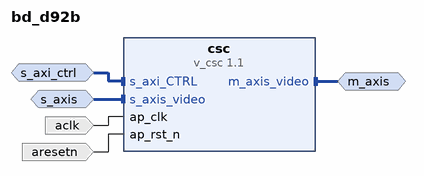
[diagram p0: block diagram of the top level]
# Vivado block design bd_d92b, xczu2cg-sfvc784-1-e, Vivado 2025.2
create_bd_design bd_d92b

create_bd_intf_port -mode Slave -vlnv xilinx.com:interface:aximm_rtl:1.0 s_axi_ctrl
set_property -dict {CONFIG.ADDR_WIDTH 16 CONFIG.PROTOCOL AXI4LITE} [get_bd_intf_ports s_axi_ctrl]
create_bd_intf_port -mode Slave -vlnv xilinx.com:interface:axis_rtl:1.0 s_axis
create_bd_intf_port -mode Master -vlnv xilinx.com:interface:axis_rtl:1.0 m_axis
create_bd_port -dir I -type clk aclk
create_bd_port -dir I -type rst aresetn

create_bd_cell -type ip -vlnv xilinx.com:ip:v_csc:1.1 csc
set_property -dict [list \
  CONFIG.ENABLE_420 0 \
  CONFIG.ENABLE_422 1 \
  CONFIG.ENABLE_WINDOW 1 \
  CONFIG.MAX_DATA_WIDTH 8 \
  CONFIG.SAMPLES_PER_CLOCK 2 \
  CONFIG.USE_URAM 0 \
  CONFIG.V_CSC_MAX_HEIGHT 1080 \
  CONFIG.V_CSC_MAX_WIDTH 1920 \
] [get_bd_cells csc]

# ---- connections ----

connect_bd_intf_net -intf_net intf_net_bdry_in_s_axi_ctrl [get_bd_intf_ports s_axi_ctrl] [get_bd_intf_pins csc/s_axi_CTRL]
connect_bd_intf_net -intf_net intf_net_bdry_in_s_axis [get_bd_intf_ports s_axis] [get_bd_intf_pins csc/s_axis_video]
connect_bd_intf_net -intf_net intf_net_csc_m_axis_video [get_bd_intf_pins csc/m_axis_video] [get_bd_intf_ports m_axis]
connect_bd_net -net net_bdry_in_aclk [get_bd_ports aclk] [get_bd_pins csc/ap_clk]
connect_bd_net -net net_bdry_in_aresetn [get_bd_ports aresetn] [get_bd_pins csc/ap_rst_n]

# ---- address map ----
assign_bd_address -offset 0x0000 -range 64K -target_address_space [get_bd_addr_spaces s_axi_ctrl] [get_bd_addr_segs csc/s_axi_CTRL/Reg]

validate_bd_design
save_bd_design
